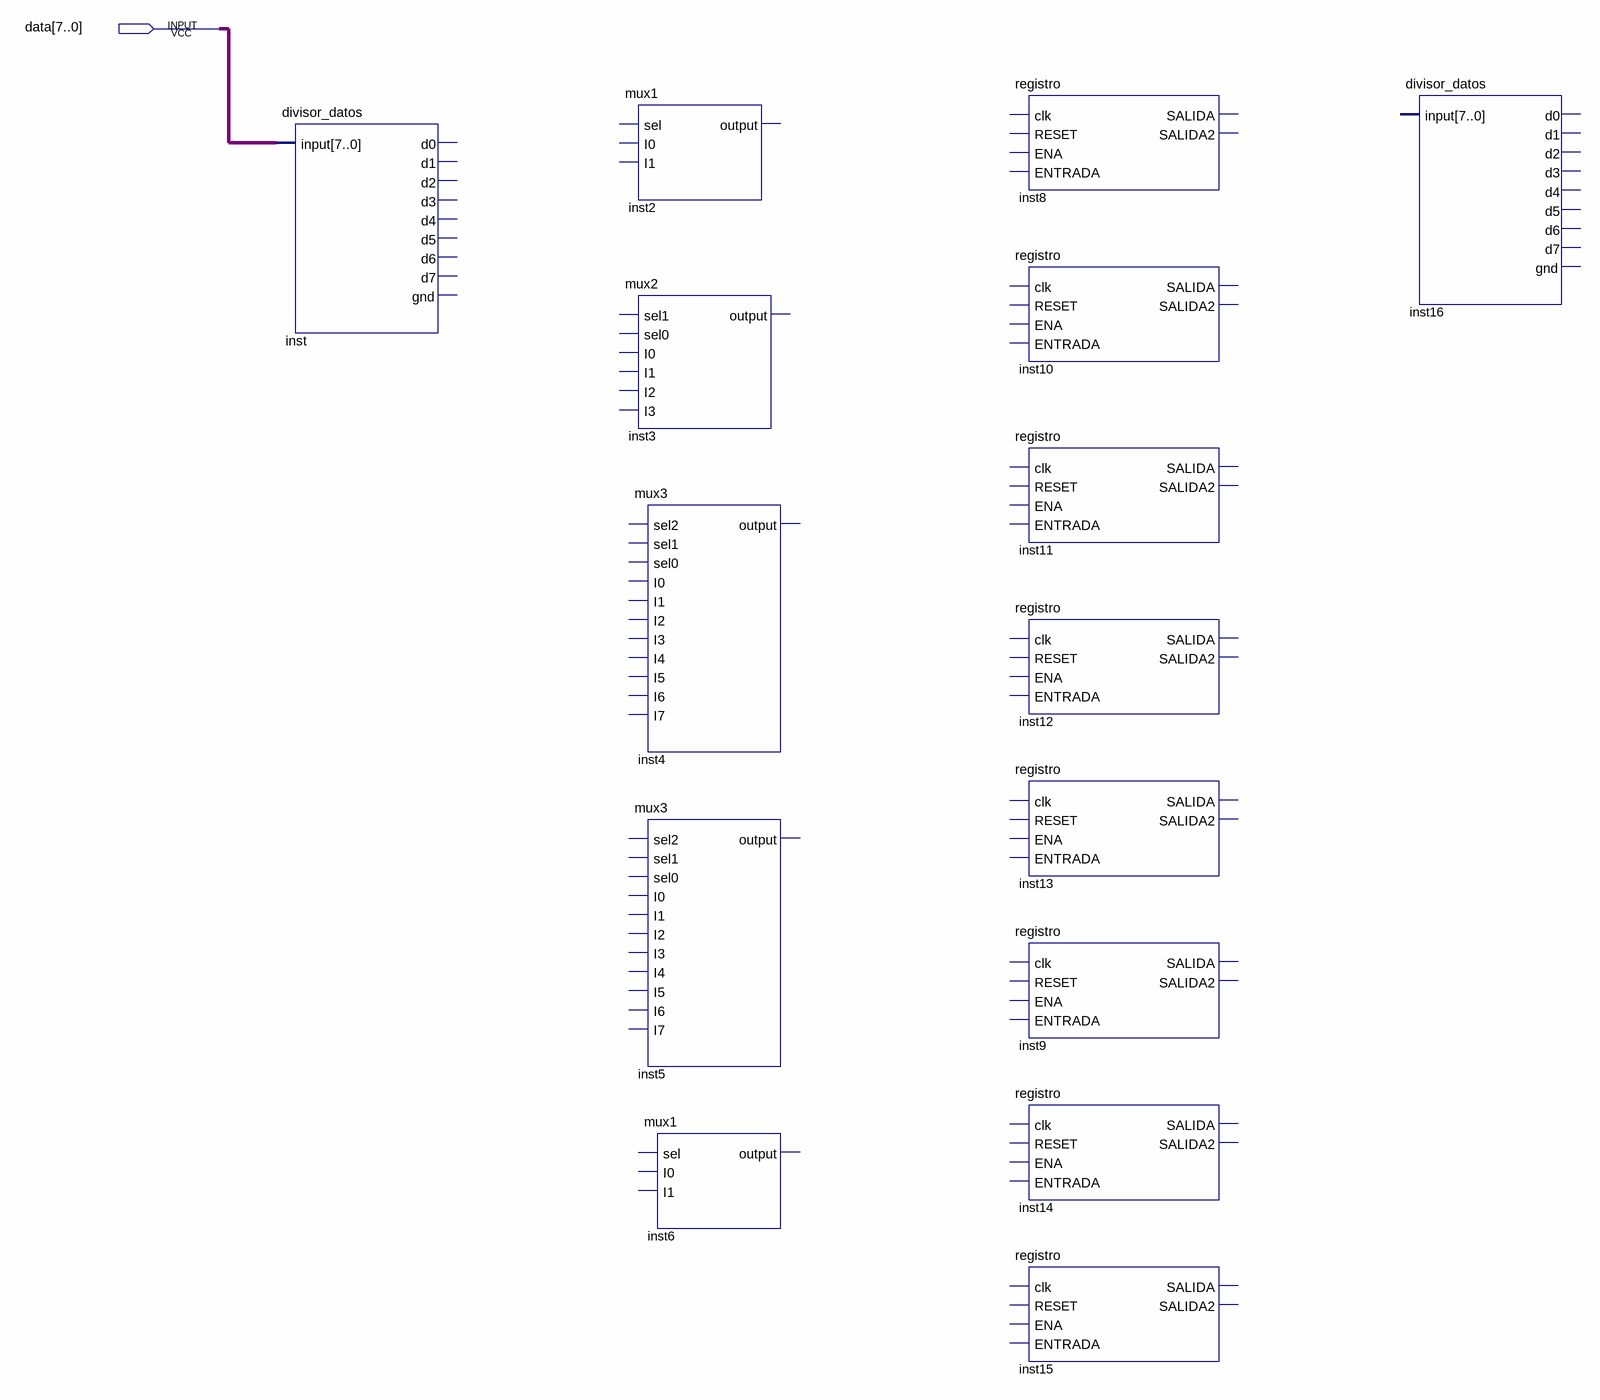
[diagram p0: schematic sheet]
// Quartus schematic principal.bdf as structural Verilog: 15 symbols, 1 pins
module principal (
  input  [7:0] data
);

  divisor_datos inst (.\input (data));  // open: d0, d1, d2, d3, d4, d5, d6, d7, gnd
  mux1 inst2 ();  // open: sel, I0, I1, output
  mux2 inst3 ();  // open: sel1, sel0, I0, I1, I2, I3, output
  mux3 inst4 ();  // open: sel2, sel1, sel0, I0, I1, I2, I3, I4, I5, I6, I7, output
  mux3 inst5 ();  // open: sel2, sel1, sel0, I0, I1, I2, I3, I4, I5, I6, I7, output
  mux1 inst6 ();  // open: sel, I0, I1, output
  registro inst8 ();  // open: clk, RESET, ENA, ENTRADA, SALIDA, SALIDA2
  registro inst10 ();  // open: clk, RESET, ENA, ENTRADA, SALIDA, SALIDA2
  registro inst11 ();  // open: clk, RESET, ENA, ENTRADA, SALIDA, SALIDA2
  registro inst12 ();  // open: clk, RESET, ENA, ENTRADA, SALIDA, SALIDA2
  registro inst13 ();  // open: clk, RESET, ENA, ENTRADA, SALIDA, SALIDA2
  registro inst9 ();  // open: clk, RESET, ENA, ENTRADA, SALIDA, SALIDA2
  registro inst14 ();  // open: clk, RESET, ENA, ENTRADA, SALIDA, SALIDA2
  registro inst15 ();  // open: clk, RESET, ENA, ENTRADA, SALIDA, SALIDA2
  divisor_datos inst16 ();  // open: input, d0, d1, d2, d3, d4, d5, d6, d7, gnd
endmodule
